# Altium schematic sheet m14sim.SchDoc
size A4
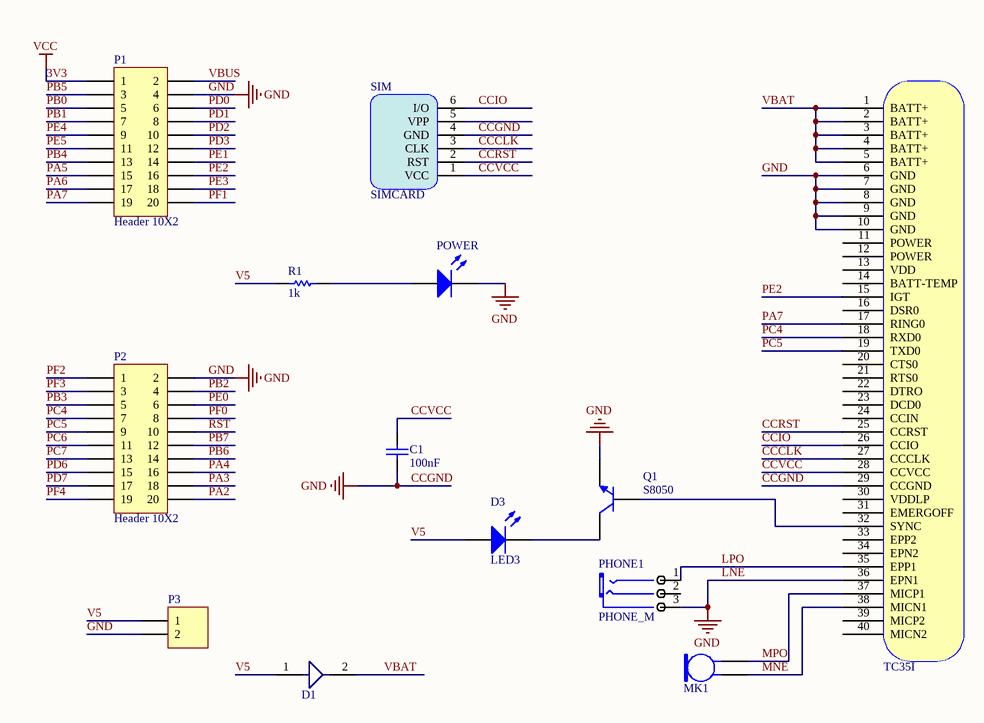
[diagram p0: m14sim.SchDoc]

## Parts
C1  value 100nF  [CAP_0805]  (hidden comment: Cap Semi)
D1  DIAO  [DIAO]  (value not drawn)
D3  LED3  [LED_0603_RED]
MK1  Mic2  [PIN2]  (value not drawn)
P1  Header 10X2  [HDR2X10]
P2  Header 10X2  [HDR2X10]
P3  Header 2  [MKDSN_2RMI]  (value not drawn)
PHONE1  PHONE_M  [PHONE_ST]
POWER  POWER  [LED_0603_RED]  (value not drawn)
Q1  S8050  [SOT23]
R1  value 1k  [RES_0603]  (hidden comment: Res Semi)
SIM  SIMCARD  [SIM6]
ZIF40  TC35I  [ZIF]

## Nets
3V3: P1.1  [also labelled VCC]
CCGND: C1.1 P1.4 P2.2 P3.2 PHONE1.3(COM) POWER.2(K) Q1.2(E) SIM.4(GND) ZIF40.6(GND) ZIF40.7(GND) ZIF40.8(GND) ZIF40.9(GND) ZIF40.10(GND) ZIF40.29(CCGND) ZIF40.36(EPN1)  [also labelled GND, LNE]
CCCLK: SIM.3(CLK) ZIF40.27(CCCLK)
CCIO: SIM.6(I/O) ZIF40.26(CCIO)
CCRST: SIM.2(RST) ZIF40.25(CCRST)
CCVCC: C1.2 SIM.1(VCC) ZIF40.28(CCVCC)
LPO: PHONE1.1(CHL) ZIF40.35(EPP1)
MNE: MK1.1 ZIF40.38(MICN1)
MPO: MK1.2 ZIF40.37(MICP1)
PA2: P2.20
PA3: P2.18
PA4: P2.16
PA5: P1.15
PA6: P1.17
PA7: P1.19 ZIF40.17(RING0)
PB0: P1.5
PB1: P1.7
PB2: P2.4
PB3: P2.5
PB4: P1.13
PB5: P1.3
PB6: P2.14
PB7: P2.12
PC4: P2.7 ZIF40.18(RXD0)
PC5: P2.9 ZIF40.19(TXD0)
PC6: P2.11
PC7: P2.13
PD0: P1.6
PD1: P1.8
PD2: P1.10
PD3: P1.12
PD6: P2.15
PD7: P2.17
PE0: P2.6
PE1: P1.14
PE2: P1.16 ZIF40.15(IGT)
PE3: P1.18
PE4: P1.9
PE5: P1.11
PF0: P2.8
PF1: P1.20
PF2: P2.1
PF3: P2.3
PF4: P2.19
RST: P2.10
V5: D1.1 D3.1(A) P3.1 R1.2
VBAT: D1.2 ZIF40.1(BATT+) ZIF40.2(BATT+) ZIF40.3(BATT+) ZIF40.4(BATT+) ZIF40.5(BATT+)
VBUS: P1.2
NetD3_2: D3.2(K) Q1.3(C)
NetPOWER_1: POWER.1(A) R1.1
NetQ1_1: Q1.1(B) ZIF40.32(SYNC)

Not connected (* = marked no-connect by the designer): PHONE1 2(CHR); SIM 5(VPP); ZIF40 11(POWER) 12(POWER) 13(VDD) 14(BATT-TEMP) 16(DSR0) 20(CTS0) 21(RTS0) 22(DTRO) 23(DCD0) 24(CCIN) 30(VDDLP) 31(EMERGOFF) 33(EPP2) 34(EPN2) 39(MICP2) 40(MICN2)

## Library data of the parts
C1 = Cap Semi: Capacitor (Semiconductor SIM Model); Published: 8-Jun-2000; LatestRevisionDate: 29-May-2009; LatestRevisionNote: IPC-7351 Footprint Added.; PackageReference: C1206; Publisher: Altium Limited; PackageDescription: Chip Capacitor
D3 POWER = LED1: Typical RED GaAs LED; Published: 8-Jun-2000; LatestRevisionDate: 08-Jul-2005; LatestRevisionNote: Mech Layer 1 removed.; PackageReference: LED-1; Publisher: Altium Limited
MK1 = Mic2: Microphone; Published: 24-Mar-1999; LatestRevisionDate: 17-Jul-2002; LatestRevisionNote: Re-released for DXP Platform.; PackageReference: PIN2; Publisher: Altium Limited
P1 P2 = Header 10X2: Header, 10-Pin, Dual row; LatestRevisionDate: 17-Jul-2002; LatestRevisionNote: Re-released for DXP Platform.; Publisher: Altium Limited
P3 = Header 2: Header, 2-Pin; LatestRevisionDate: 17-Jul-2002; LatestRevisionNote: Re-released for DXP Platform.; Publisher: Altium Limited
Q1 = BC848W: NPN General-purpose Transistor; Published: 17-Sep-2003; LatestRevisionDate: 12-Dec-2006; LatestRevisionNote: IPC-7351 Footprint Added.; DatasheetVersion: 4-Feb-2002; PackageVersion: Apr-1999; PackageReference: SOT323; Publisher: Altium Limited; PackageDescription: 3-Pin SOT-323 Package 0.65 mm Pitch, 2.1 mm Lead Span; ComponentLink1Description: Manufacturer Link; ComponentLink1URL: http://www.semiconductors.philips.com/; ComponentLink2Description: Datasheet; ComponentLink2URL: http://www.semiconductors.philips.com/acrobat/datasheets/BC846W_BC847W_BC848W_4.pdf
R1 = Res Semi: Semiconductor Resistor; Published: 8-Jun-2000; LatestRevisionDate: 17-Jul-2002; LatestRevisionNote: Re-released for DXP Platform.; PackageReference: AXIAL-0.5; Publisher: Altium Limited